# EasyEDA schematic SCH_cube_2025-02-01.json
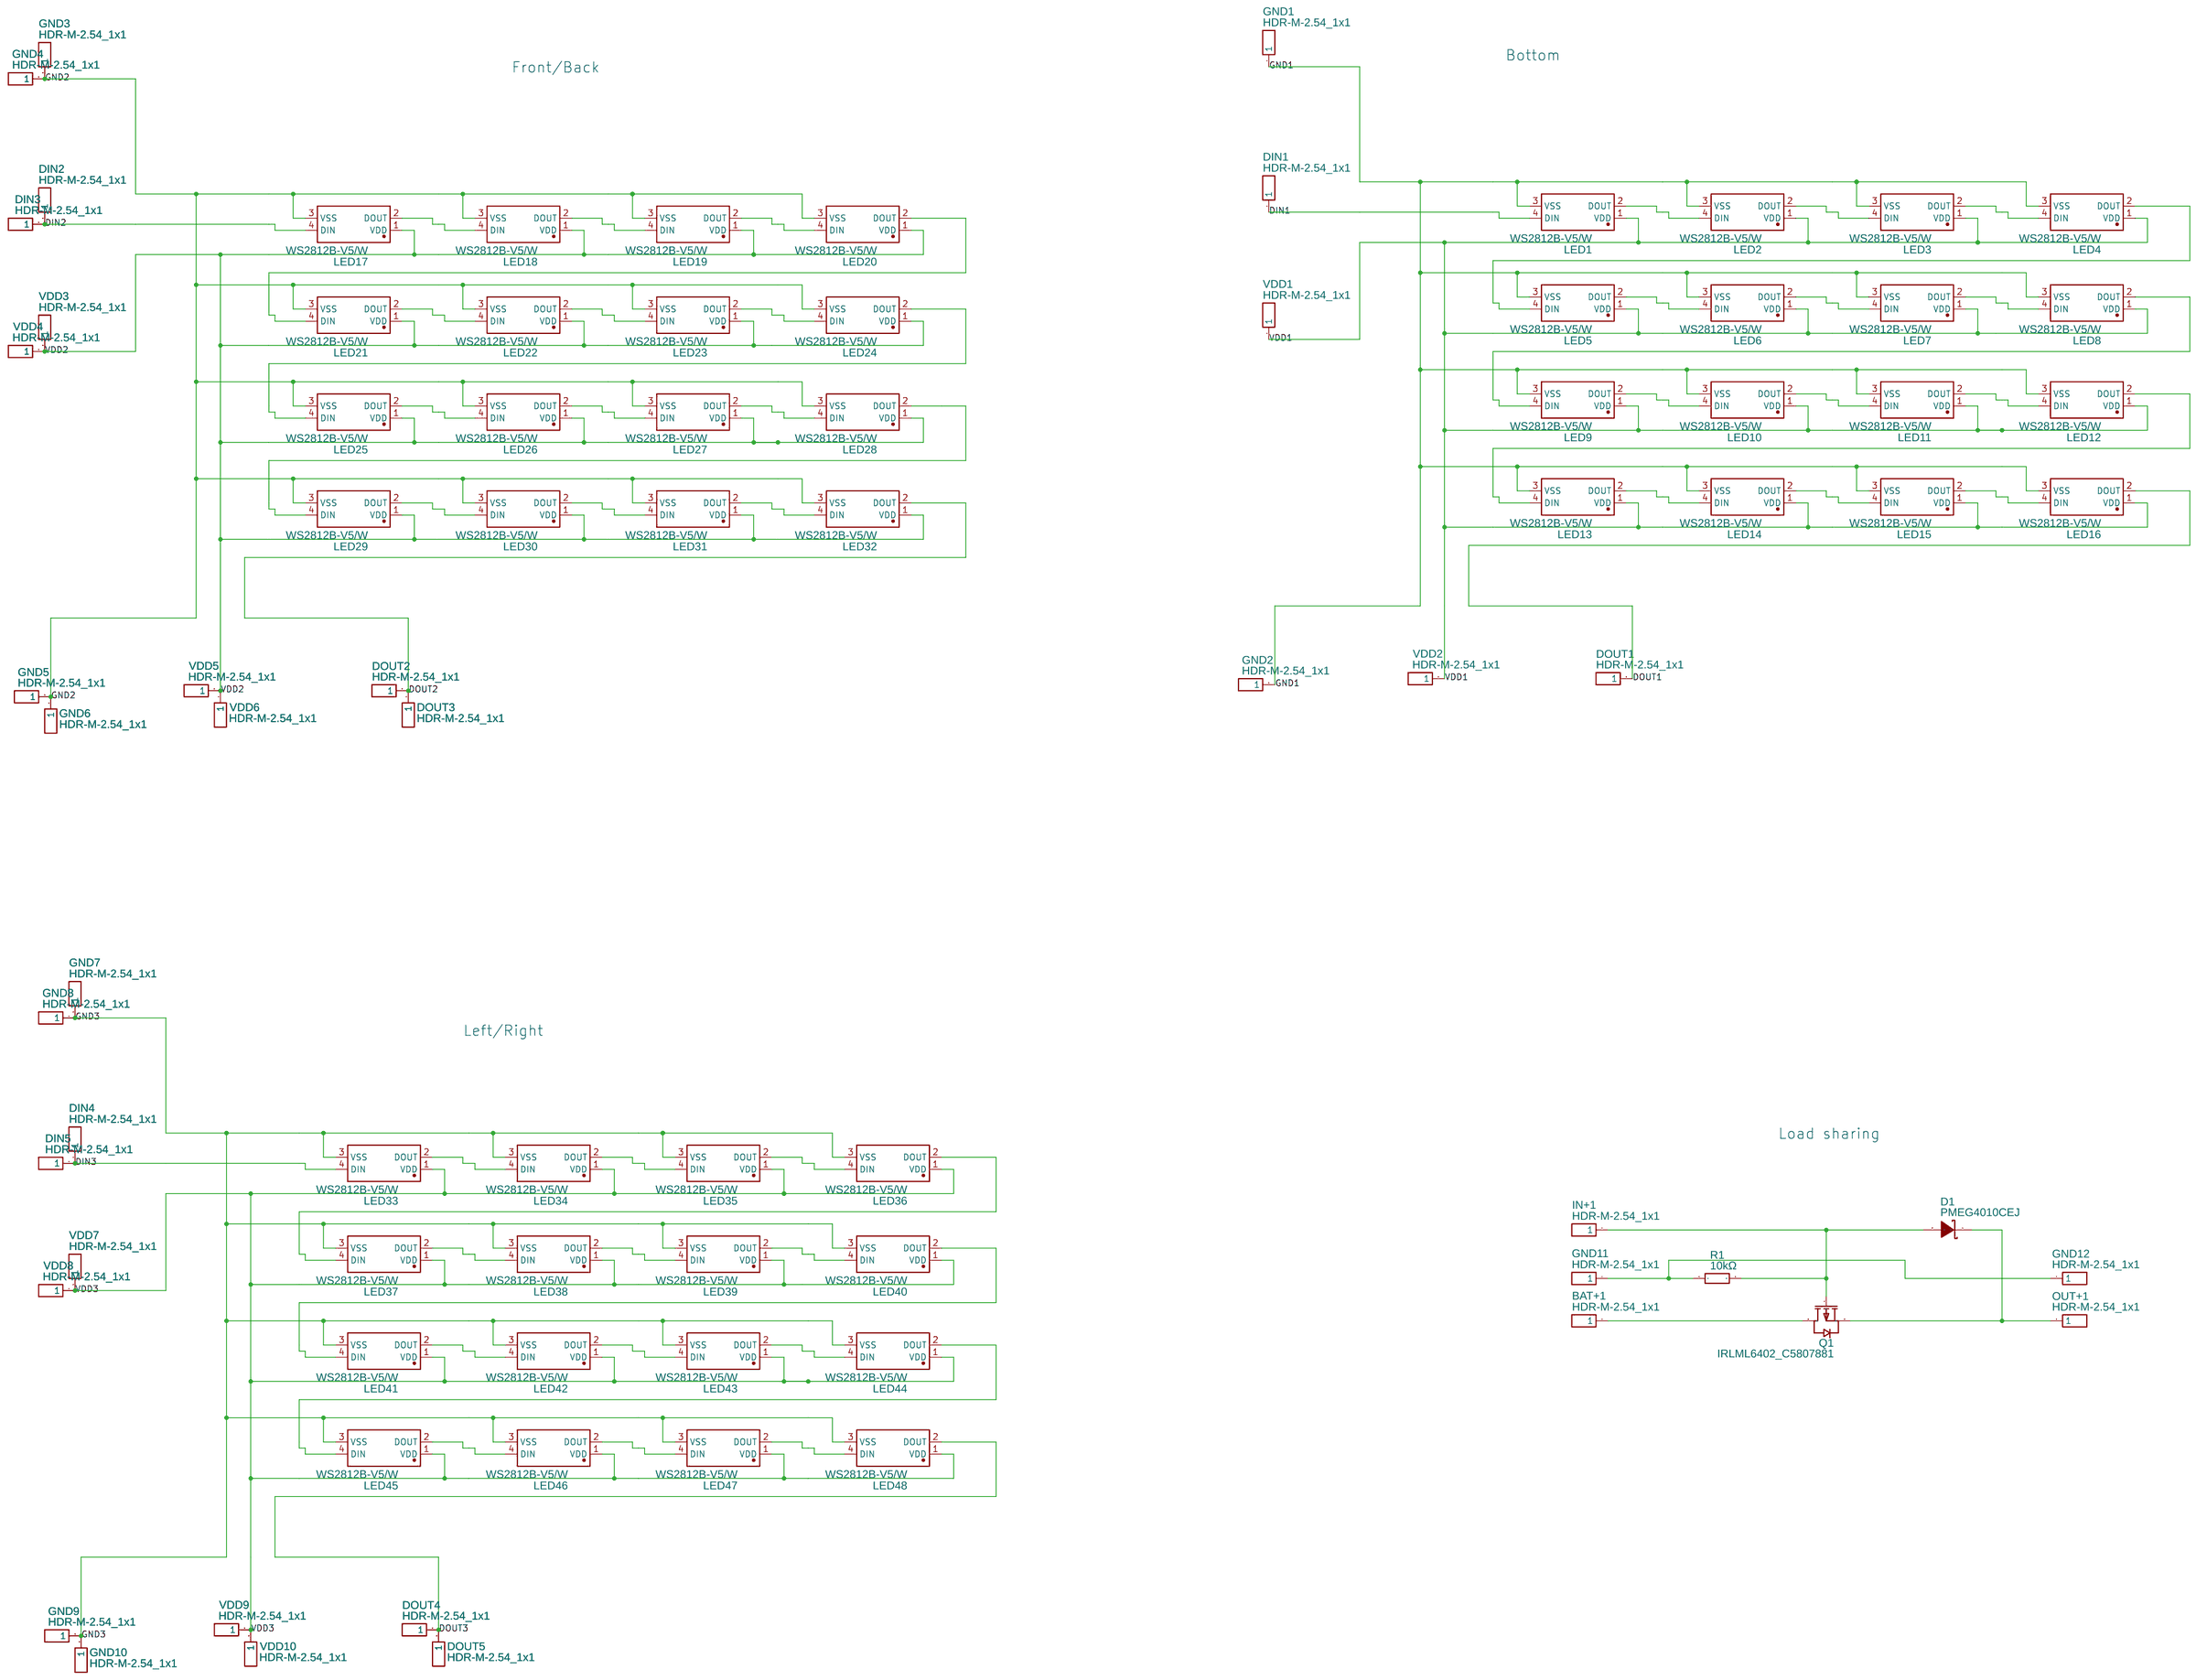
[diagram p0: schematic sheet]

## Parts
BAT+1  HDR-M-2.54_1x1  [DEFAULT_PAD]
D1  PMEG4010CEJ  [SOD-323F_L2.0-W1.6-LS2.5-RD]
DIN1  HDR-M-2.54_1x1  [DEFAULT_PAD]
DIN2  HDR-M-2.54_1x1  [DEFAULT_PAD]
DIN3  HDR-M-2.54_1x1  [DEFAULT_PAD]
DIN4  HDR-M-2.54_1x1  [DEFAULT_PAD]
DIN5  HDR-M-2.54_1x1  [DEFAULT_PAD]
DOUT1  HDR-M-2.54_1x1  [DEFAULT_PAD]
DOUT2  HDR-M-2.54_1x1  [DEFAULT_PAD]
DOUT3  HDR-M-2.54_1x1  [DEFAULT_PAD]
DOUT4  HDR-M-2.54_1x1  [DEFAULT_PAD]
DOUT5  HDR-M-2.54_1x1  [DEFAULT_PAD]
GND1  HDR-M-2.54_1x1  [DEFAULT_PAD]
GND2  HDR-M-2.54_1x1  [DEFAULT_PAD]
GND3  HDR-M-2.54_1x1  [DEFAULT_PAD]
GND4  HDR-M-2.54_1x1  [DEFAULT_PAD]
GND5  HDR-M-2.54_1x1  [DEFAULT_PAD]
GND6  HDR-M-2.54_1x1  [DEFAULT_PAD]
GND7  HDR-M-2.54_1x1  [DEFAULT_PAD]
GND8  HDR-M-2.54_1x1  [DEFAULT_PAD]
GND9  HDR-M-2.54_1x1  [DEFAULT_PAD]
GND10  HDR-M-2.54_1x1  [DEFAULT_PAD]
GND11  HDR-M-2.54_1x1  [DEFAULT_PAD]
GND12  HDR-M-2.54_1x1  [DEFAULT_PAD]
IN+1  HDR-M-2.54_1x1  [DEFAULT_PAD]
LED1  WS2812B-V5/W  [LED-SMD_4P-L5.0-W5.0-TL-1]
LED2  WS2812B-V5/W  [LED-SMD_4P-L5.0-W5.0-TL-1]
LED3  WS2812B-V5/W  [LED-SMD_4P-L5.0-W5.0-TL-1]
LED4  WS2812B-V5/W  [LED-SMD_4P-L5.0-W5.0-TL-1]
LED5  WS2812B-V5/W  [LED-SMD_4P-L5.0-W5.0-TL-1]
LED6  WS2812B-V5/W  [LED-SMD_4P-L5.0-W5.0-TL-1]
LED7  WS2812B-V5/W  [LED-SMD_4P-L5.0-W5.0-TL-1]
LED8  WS2812B-V5/W  [LED-SMD_4P-L5.0-W5.0-TL-1]
LED9  WS2812B-V5/W  [LED-SMD_4P-L5.0-W5.0-TL-1]
LED10  WS2812B-V5/W  [LED-SMD_4P-L5.0-W5.0-TL-1]
LED11  WS2812B-V5/W  [LED-SMD_4P-L5.0-W5.0-TL-1]
LED12  WS2812B-V5/W  [LED-SMD_4P-L5.0-W5.0-TL-1]
LED13  WS2812B-V5/W  [LED-SMD_4P-L5.0-W5.0-TL-1]
LED14  WS2812B-V5/W  [LED-SMD_4P-L5.0-W5.0-TL-1]
LED15  WS2812B-V5/W  [LED-SMD_4P-L5.0-W5.0-TL-1]
LED16  WS2812B-V5/W  [LED-SMD_4P-L5.0-W5.0-TL-1]
LED17  WS2812B-V5/W  [LED-SMD_4P-L5.0-W5.0-TL-1]
LED18  WS2812B-V5/W  [LED-SMD_4P-L5.0-W5.0-TL-1]
LED19  WS2812B-V5/W  [LED-SMD_4P-L5.0-W5.0-TL-1]
LED20  WS2812B-V5/W  [LED-SMD_4P-L5.0-W5.0-TL-1]
LED21  WS2812B-V5/W  [LED-SMD_4P-L5.0-W5.0-TL-1]
LED22  WS2812B-V5/W  [LED-SMD_4P-L5.0-W5.0-TL-1]
LED23  WS2812B-V5/W  [LED-SMD_4P-L5.0-W5.0-TL-1]
LED24  WS2812B-V5/W  [LED-SMD_4P-L5.0-W5.0-TL-1]
LED25  WS2812B-V5/W  [LED-SMD_4P-L5.0-W5.0-TL-1]
LED26  WS2812B-V5/W  [LED-SMD_4P-L5.0-W5.0-TL-1]
LED27  WS2812B-V5/W  [LED-SMD_4P-L5.0-W5.0-TL-1]
LED28  WS2812B-V5/W  [LED-SMD_4P-L5.0-W5.0-TL-1]
LED29  WS2812B-V5/W  [LED-SMD_4P-L5.0-W5.0-TL-1]
LED30  WS2812B-V5/W  [LED-SMD_4P-L5.0-W5.0-TL-1]
LED31  WS2812B-V5/W  [LED-SMD_4P-L5.0-W5.0-TL-1]
LED32  WS2812B-V5/W  [LED-SMD_4P-L5.0-W5.0-TL-1]
LED33  WS2812B-V5/W  [LED-SMD_4P-L5.0-W5.0-TL-1]
LED34  WS2812B-V5/W  [LED-SMD_4P-L5.0-W5.0-TL-1]
LED35  WS2812B-V5/W  [LED-SMD_4P-L5.0-W5.0-TL-1]
LED36  WS2812B-V5/W  [LED-SMD_4P-L5.0-W5.0-TL-1]
LED37  WS2812B-V5/W  [LED-SMD_4P-L5.0-W5.0-TL-1]
LED38  WS2812B-V5/W  [LED-SMD_4P-L5.0-W5.0-TL-1]
LED39  WS2812B-V5/W  [LED-SMD_4P-L5.0-W5.0-TL-1]
LED40  WS2812B-V5/W  [LED-SMD_4P-L5.0-W5.0-TL-1]
LED41  WS2812B-V5/W  [LED-SMD_4P-L5.0-W5.0-TL-1]
LED42  WS2812B-V5/W  [LED-SMD_4P-L5.0-W5.0-TL-1]
LED43  WS2812B-V5/W  [LED-SMD_4P-L5.0-W5.0-TL-1]
LED44  WS2812B-V5/W  [LED-SMD_4P-L5.0-W5.0-TL-1]
LED45  WS2812B-V5/W  [LED-SMD_4P-L5.0-W5.0-TL-1]
LED46  WS2812B-V5/W  [LED-SMD_4P-L5.0-W5.0-TL-1]
LED47  WS2812B-V5/W  [LED-SMD_4P-L5.0-W5.0-TL-1]
LED48  WS2812B-V5/W  [LED-SMD_4P-L5.0-W5.0-TL-1]
OUT+1  HDR-M-2.54_1x1  [DEFAULT_PAD]
Q1  IRLML6402_C5807881  [SOT-23-3_L2.9-W1.3-P1.90-LS2.4-BR]
R1  10kΩ  [R1206]
VDD1  HDR-M-2.54_1x1  [DEFAULT_PAD]
VDD2  HDR-M-2.54_1x1  [DEFAULT_PAD]
VDD3  HDR-M-2.54_1x1  [DEFAULT_PAD]
VDD4  HDR-M-2.54_1x1  [DEFAULT_PAD]
VDD5  HDR-M-2.54_1x1  [DEFAULT_PAD]
VDD6  HDR-M-2.54_1x1  [DEFAULT_PAD]
VDD7  HDR-M-2.54_1x1  [DEFAULT_PAD]
VDD8  HDR-M-2.54_1x1  [DEFAULT_PAD]
VDD9  HDR-M-2.54_1x1  [DEFAULT_PAD]
VDD10  HDR-M-2.54_1x1  [DEFAULT_PAD]

## Library data of the parts
BAT+1 DIN1-DIN5 DOUT1-DOUT5 GND1-GND12 IN+1 OUT+1 VDD1-VDD10 = HDR-M-2.54_1x1: Supplier Part: C81276; Supplier: LCSC; Contributor: LCEDA_Lib
D1 = PMEG4010CEJ: Supplier: LCSC; Manufacturer: Nexperia(安世); Manufacturer Part: PMEG4010CEJ,115; Supplier Part: C50704; JLCPCB Part Class: Extended Part
LED1-LED48 = WS2812B-V5/W: Contributor: lcsc; Supplier: LCSC; Supplier Part: C2874885; Manufacturer: worldsemi; JLCPCB Part Class: Extended Part
Q1 = IRLML6402_C5807881: Contributor: lcsc; Supplier: LCSC; Supplier Part: C5807881; Manufacturer: GOODWORK(固得沃克); Manufacturer Part: IRLML6402; JLCPCB Part Class: Extended Part
R1 = 1206W4J0103T5E: Supplier: LCSC; Manufacturer: UNI-ROYAL(厚声); Supplier Part: C1489; JLCPCB Part Class: Extended Part

## Nets
GND1: GND1.1 GND2.1 LED1.3(VSS) LED2.3(VSS) LED3.3(VSS) LED4.3(VSS) LED5.3(VSS) LED6.3(VSS) LED7.3(VSS) LED8.3(VSS) LED9.3(VSS) LED10.3(VSS) LED11.3(VSS) LED12.3(VSS) LED13.3(VSS) LED14.3(VSS) LED15.3(VSS) LED16.3(VSS)
GND2: GND3.1 GND4.1 GND5.1 GND6.1 LED17.3(VSS) LED18.3(VSS) LED19.3(VSS) LED20.3(VSS) LED21.3(VSS) LED22.3(VSS) LED23.3(VSS) LED24.3(VSS) LED25.3(VSS) LED26.3(VSS) LED27.3(VSS) LED28.3(VSS) LED29.3(VSS) LED30.3(VSS) LED31.3(VSS) LED32.3(VSS)
GND3: GND7.1 GND8.1 GND9.1 GND10.1 LED33.3(VSS) LED34.3(VSS) LED35.3(VSS) LED36.3(VSS) LED37.3(VSS) LED38.3(VSS) LED39.3(VSS) LED40.3(VSS) LED41.3(VSS) LED42.3(VSS) LED43.3(VSS) LED44.3(VSS) LED45.3(VSS) LED46.3(VSS) LED47.3(VSS) LED48.3(VSS)
VDD1: LED1.1(VDD) LED2.1(VDD) LED3.1(VDD) LED4.1(VDD) LED5.1(VDD) LED6.1(VDD) LED7.1(VDD) LED8.1(VDD) LED9.1(VDD) LED10.1(VDD) LED11.1(VDD) LED12.1(VDD) LED13.1(VDD) LED14.1(VDD) LED15.1(VDD) LED16.1(VDD) VDD1.1 VDD2.1
VDD2: LED17.1(VDD) LED18.1(VDD) LED19.1(VDD) LED20.1(VDD) LED21.1(VDD) LED22.1(VDD) LED23.1(VDD) LED24.1(VDD) LED25.1(VDD) LED26.1(VDD) LED27.1(VDD) LED28.1(VDD) LED29.1(VDD) LED30.1(VDD) LED31.1(VDD) LED32.1(VDD) VDD3.1 VDD4.1 VDD5.1 VDD6.1
VDD3: LED33.1(VDD) LED34.1(VDD) LED35.1(VDD) LED36.1(VDD) LED37.1(VDD) LED38.1(VDD) LED39.1(VDD) LED40.1(VDD) LED41.1(VDD) LED42.1(VDD) LED43.1(VDD) LED44.1(VDD) LED45.1(VDD) LED46.1(VDD) LED47.1(VDD) LED48.1(VDD) VDD7.1 VDD8.1 VDD9.1 VDD10.1
DIN1: DIN1.1 LED1.4(DIN)
DIN2: DIN2.1 DIN3.1 LED17.4(DIN)
DIN3: DIN4.1 DIN5.1 LED33.4(DIN)
DOUT1: DOUT1.1 LED16.2(DOUT)
DOUT2: DOUT2.1 DOUT3.1 LED32.2(DOUT)
DOUT3: DOUT4.1 DOUT5.1 LED48.2(DOUT)
Net-(BAT+1-1): BAT+1.1 Q1.3(D)
Net-(D1-1): D1.1(C) OUT+1.1 Q1.2(S)
Net-(D1-2): D1.2(A) IN+1.1 Q1.1(G) R1.2
Net-(GND11-1): GND11.1 GND12.1 R1.1
Net-(LED1-2): LED1.2(DOUT) LED2.4(DIN)
Net-(LED2-2): LED2.2(DOUT) LED3.4(DIN)
Net-(LED3-2): LED3.2(DOUT) LED4.4(DIN)
Net-(LED4-2): LED4.2(DOUT) LED5.4(DIN)
Net-(LED5-2): LED5.2(DOUT) LED6.4(DIN)
Net-(LED6-2): LED6.2(DOUT) LED7.4(DIN)
Net-(LED7-2): LED7.2(DOUT) LED8.4(DIN)
Net-(LED8-2): LED8.2(DOUT) LED9.4(DIN)
Net-(LED9-2): LED9.2(DOUT) LED10.4(DIN)
Net-(LED10-2): LED10.2(DOUT) LED11.4(DIN)
Net-(LED11-2): LED11.2(DOUT) LED12.4(DIN)
Net-(LED12-2): LED12.2(DOUT) LED13.4(DIN)
Net-(LED13-2): LED13.2(DOUT) LED14.4(DIN)
Net-(LED14-2): LED14.2(DOUT) LED15.4(DIN)
Net-(LED15-2): LED15.2(DOUT) LED16.4(DIN)
Net-(LED17-2): LED17.2(DOUT) LED18.4(DIN)
Net-(LED18-2): LED18.2(DOUT) LED19.4(DIN)
Net-(LED19-2): LED19.2(DOUT) LED20.4(DIN)
Net-(LED20-2): LED20.2(DOUT) LED21.4(DIN)
Net-(LED21-2): LED21.2(DOUT) LED22.4(DIN)
Net-(LED22-2): LED22.2(DOUT) LED23.4(DIN)
Net-(LED23-2): LED23.2(DOUT) LED24.4(DIN)
Net-(LED24-2): LED24.2(DOUT) LED25.4(DIN)
Net-(LED25-2): LED25.2(DOUT) LED26.4(DIN)
Net-(LED26-2): LED26.2(DOUT) LED27.4(DIN)
Net-(LED27-2): LED27.2(DOUT) LED28.4(DIN)
Net-(LED28-2): LED28.2(DOUT) LED29.4(DIN)
Net-(LED29-2): LED29.2(DOUT) LED30.4(DIN)
Net-(LED30-2): LED30.2(DOUT) LED31.4(DIN)
Net-(LED31-2): LED31.2(DOUT) LED32.4(DIN)
Net-(LED33-2): LED33.2(DOUT) LED34.4(DIN)
Net-(LED34-2): LED34.2(DOUT) LED35.4(DIN)
Net-(LED35-2): LED35.2(DOUT) LED36.4(DIN)
Net-(LED36-2): LED36.2(DOUT) LED37.4(DIN)
Net-(LED37-2): LED37.2(DOUT) LED38.4(DIN)
Net-(LED38-2): LED38.2(DOUT) LED39.4(DIN)
Net-(LED39-2): LED39.2(DOUT) LED40.4(DIN)
Net-(LED40-2): LED40.2(DOUT) LED41.4(DIN)
Net-(LED41-2): LED41.2(DOUT) LED42.4(DIN)
Net-(LED42-2): LED42.2(DOUT) LED43.4(DIN)
Net-(LED43-2): LED43.2(DOUT) LED44.4(DIN)
Net-(LED44-2): LED44.2(DOUT) LED45.4(DIN)
Net-(LED45-2): LED45.2(DOUT) LED46.4(DIN)
Net-(LED46-2): LED46.2(DOUT) LED47.4(DIN)
Net-(LED47-2): LED47.2(DOUT) LED48.4(DIN)

## Notes on the sheet
- 1
- 2
- 3
- 4
- 5
- 6
- 7
- 8
- 9
- 10
- 11
- 12
- A
- Bottom
- A
- Front/Back
- B
- B
- C
- C
- D
- D
- E
- E
- Left/Right
- Load sharing
- F
- F
- G
- G
- 1
- 2
- 3
- 4
- 5
- 6
- 7
- 8
- 9
- 10
- 11
- 12
